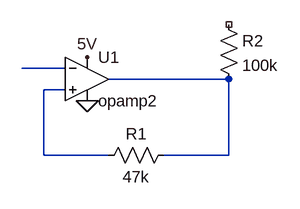
[diagram p0: schematic Draft1.asc]
Draft1.asc, the LTspice schematic file:
Version 4
SHEET 1 880 680
WIRE 368 304 304 304
WIRE 608 320 432 320
WIRE 368 336 336 336
WIRE 336 432 336 336
WIRE 432 432 336 432
WIRE 608 432 608 320
WIRE 608 432 512 432
FLAG 400 352 0
FLAG 400 288 5V
SYMBOL OpAmps/opamp2 400 256 R0
SYMATTR InstName U1
SYMBOL Res 528 416 R90
WINDOW 0 0 56 VBottom 2
WINDOW 3 32 56 VTop 2
SYMATTR InstName R1
SYMATTR Value 47k
SYMBOL Res 592 224 R0
SYMATTR InstName R2
SYMATTR Value 100k

The netlist it stands for:
* Draft1.asc
XU1 N003 N001 5V 0 N002 opamp2  ; pins In+ In- V+ V- OUT
R1 N002 N003 47k
R2 NC_01 N002 100k
.backanno
.end